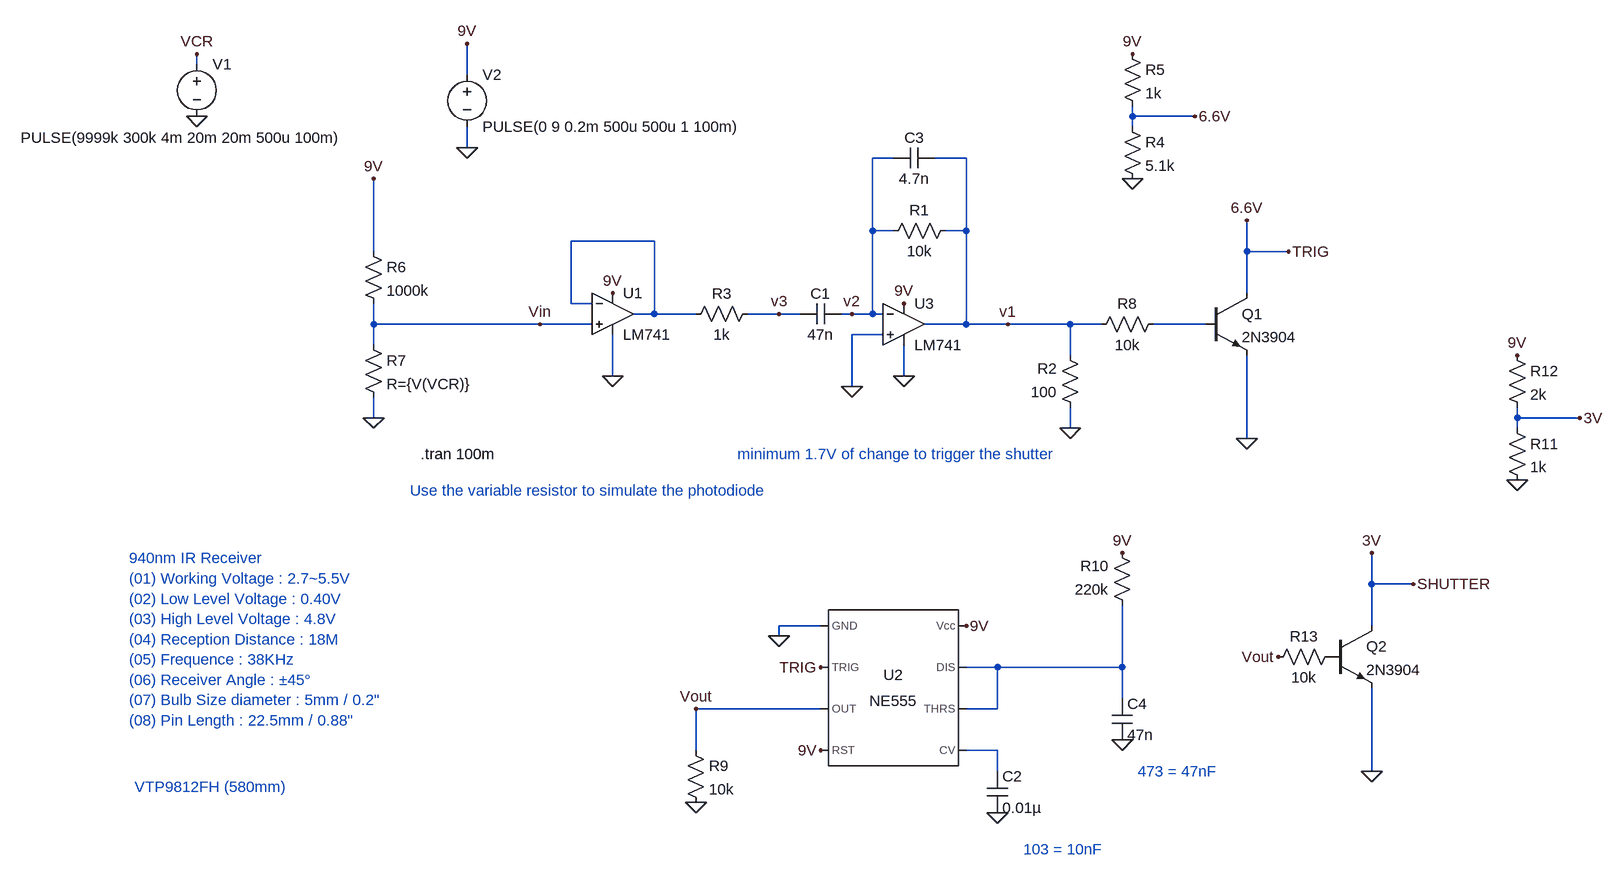
[diagram p0: schematic lightning trigger slow.asc]
lightning trigger slow.asc, the LTspice schematic file:
Version 4
SHEET 1 1220 1080
WIRE -976 -144 -976 -160
WIRE -560 -128 -560 -176
WIRE 464 -64 464 -80
WIRE 560 -64 464 -64
WIRE 464 -48 464 -64
WIRE -560 -16 -560 -48
WIRE 96 0 64 0
WIRE 208 0 160 0
WIRE 64 112 64 0
WIRE 96 112 64 112
WIRE 208 112 208 0
WIRE 208 112 176 112
WIRE -272 128 -400 128
WIRE -704 144 -704 32
WIRE 640 144 640 96
WIRE 704 144 640 144
WIRE 640 208 640 144
WIRE -400 224 -400 128
WIRE -368 224 -400 224
WIRE -272 240 -272 128
WIRE -272 240 -304 240
WIRE -208 240 -272 240
WIRE -80 240 -128 240
WIRE -48 240 -80 240
WIRE 32 240 16 240
WIRE 64 240 64 112
WIRE 64 240 32 240
WIRE 80 240 64 240
WIRE -704 256 -704 224
WIRE -448 256 -704 256
WIRE -368 256 -448 256
WIRE 208 256 208 112
WIRE 208 256 144 256
WIRE 272 256 208 256
WIRE 368 256 272 256
WIRE 416 256 368 256
WIRE 576 256 496 256
WIRE 80 272 32 272
WIRE -704 288 -704 256
WIRE 368 304 368 256
WIRE -336 336 -336 272
WIRE 112 336 112 288
WIRE 32 352 32 272
WIRE -704 400 -704 368
WIRE 1056 400 1056 384
WIRE 1152 400 1056 400
WIRE 368 416 368 384
WIRE 1056 416 1056 400
WIRE 640 432 640 304
WIRE 832 656 832 608
WIRE 896 656 832 656
WIRE -16 720 -80 720
WIRE 832 720 832 656
WIRE -80 736 -80 720
WIRE 256 784 208 784
WIRE 448 784 448 688
WIRE 448 784 256 784
WIRE 448 832 448 784
WIRE -16 848 -208 848
WIRE 256 848 256 784
WIRE 256 848 208 848
WIRE -208 912 -208 848
WIRE 256 912 208 912
WIRE 256 944 256 912
WIRE 832 944 832 816
FLAG 112 224 9V
FLAG 112 336 0
FLAG -448 256 Vin
FLAG -976 -64 0
FLAG -560 -176 9V
FLAG -560 -16 0
FLAG 368 416 0
FLAG 640 432 0
FLAG 464 -160 9V
FLAG -336 208 9V
FLAG -336 336 0
FLAG 704 144 TRIG
FLAG 464 32 0
FLAG 560 -64 6.6V
FLAG 272 256 v1
FLAG -976 -160 VCR
FLAG -704 400 0
FLAG -704 32 9V
FLAG 32 352 0
FLAG 32 240 v2
FLAG -80 240 v3
FLAG 640 96 6.6V
FLAG -80 736 0
FLAG -16 784 TRIG
FLAG -208 848 Vout
FLAG 256 1008 0
FLAG 448 896 0
FLAG 448 608 9V
FLAG 208 720 9V
FLAG -208 992 0
FLAG -16 912 9V
FLAG 832 944 0
FLAG 896 656 SHUTTER
FLAG 832 608 3V
FLAG 1056 304 9V
FLAG 1056 496 0
FLAG 1152 400 3V
FLAG 688 768 Vout
SYMBOL cap 16 224 R90
WINDOW 0 0 32 VBottom 2
WINDOW 3 32 32 VTop 2
SYMATTR InstName C1
SYMATTR Value 47n
SYMBOL res 192 96 R90
WINDOW 0 0 56 VBottom 2
WINDOW 3 32 56 VTop 2
SYMATTR InstName R1
SYMATTR Value 10k
SYMBOL voltage -976 -160 R0
WINDOW 3 -271 129 Left 2
WINDOW 123 0 0 Left 0
WINDOW 39 0 0 Left 0
SYMATTR Value PULSE(9999k 300k 4m 20m 20m 500u 100m)
SYMATTR InstName V1
SYMBOL voltage -560 -144 R0
WINDOW 123 0 0 Left 0
SYMATTR InstName V2
SYMATTR Value PULSE(0 9 0.2m 500u 500u 1 100m)
SYMATTR SpiceLine Rser=0
SYMBOL cap 160 -16 R90
WINDOW 0 0 32 VBottom 2
WINDOW 3 32 32 VTop 2
SYMATTR InstName C3
SYMATTR Value 4.7n
SYMBOL res 384 400 R180
WINDOW 0 36 76 Left 2
WINDOW 3 36 40 Left 2
SYMATTR InstName R2
SYMATTR Value 100
SYMBOL res -224 256 R270
WINDOW 0 32 56 VTop 2
WINDOW 3 0 56 VBottom 2
SYMATTR InstName R3
SYMATTR Value 1k
SYMBOL res 448 -64 R0
SYMATTR InstName R4
SYMATTR Value 5.1k
SYMBOL LM741 112 192 R0
SYMATTR InstName U3
SYMBOL LM741 -336 176 R0
SYMATTR InstName U1
SYMBOL npn 576 208 R0
SYMATTR InstName Q1
SYMATTR Value 2N3904
SYMBOL res 448 -176 R0
SYMATTR InstName R5
SYMATTR Value 1k
SYMBOL res -720 128 R0
SYMATTR InstName R6
SYMATTR Value 1000k
SYMBOL res -720 272 R0
SYMATTR InstName R7
SYMATTR Value R={V(VCR)}
SYMBOL res 512 240 R90
WINDOW 0 0 56 VBottom 2
WINDOW 3 32 56 VTop 2
SYMATTR InstName R8
SYMATTR Value 10k
SYMBOL NE555 96 816 R0
SYMATTR InstName U2
SYMBOL res -224 896 R0
SYMATTR InstName R9
SYMATTR Value 10k
SYMBOL res 464 704 R180
WINDOW 0 36 76 Left 2
WINDOW 3 36 40 Left 2
SYMATTR InstName R10
SYMATTR Value 220k
SYMBOL cap 240 944 R0
SYMATTR InstName C2
SYMATTR Value 0.01µ
SYMBOL cap 432 832 R0
SYMATTR InstName C4
SYMATTR Value 47n
SYMBOL npn 768 720 R0
SYMATTR InstName Q2
SYMATTR Value 2N3904
SYMBOL res 1040 400 R0
SYMATTR InstName R11
SYMATTR Value 1k
SYMBOL res 1040 288 R0
SYMATTR InstName R12
SYMATTR Value 2k
SYMBOL res 784 752 R90
WINDOW 0 0 56 VBottom 2
WINDOW 3 32 56 VTop 2
SYMATTR InstName R13
SYMATTR Value 10k
TEXT -632 456 Left 2 !.tran 100m
TEXT -648 512 Left 2 ;Use the variable resistor to simulate the photodiode
TEXT -144 456 Left 2 ;minimum 1.7V of change to trigger the shutter
TEXT 296 1064 Left 2 ;103 = 10nF
TEXT 472 944 Left 2 ;473 = 47nF
TEXT -1080 616 Left 2 ;940nm IR Receiver\n(01) Working Voltage : 2.7~5.5V\n(02) Low Level Voltage : 0.40V\n(03) High Level Voltage : 4.8V\n(04) Reception Distance : 18M\n(05) Frequence : 38KHz\n(06) Receiver Angle : ±45°\n(07) Bulb Size diameter : 5mm / 0.2"\n(08) Pin Length : 22.5mm / 0.88"
TEXT -1072 968 Left 2 ;VTP9812FH (580mm)

The netlist it stands for:
* lightning trigger slow.asc
C1 v2 v3 47n
R1 v1 v2 10k
V1 VCR 0 PULSE(9999k 300k 4m 20m 20m 500u 100m)
V2 9V 0 PULSE(0 9 0.2m 500u 500u 1 100m) Rser=0
C3 v1 v2 4.7n
R2 0 v1 100
R3 N001 v3 1k
R4 6.6V 0 5.1k
XU3 0 v2 9V 0 v1 LM741  ; pins In+ In- V+ V- OUT
XU1 Vin N001 9V 0 N001 LM741  ; pins In+ In- V+ V- OUT
Q1 6.6V N002 0 0 2N3904
R5 9V 6.6V 1k
R6 9V Vin 1000k
R7 Vin 0 R={V(VCR)}
R8 N002 v1 10k
XU2 0 6.6V Vout 9V N004 N003 N003 9V NE555  ; pins GND TRIG OUT RST CV THRS DIS Vcc
R9 Vout 0 10k
R10 N003 9V 220k
C2 N004 0 0.01µ
C4 N003 0 47n
Q2 3V P001 0 0 2N3904
R11 3V 0 1k
R12 9V 3V 2k
R13 P001 Vout 10k
.model NPN NPN
.model PNP PNP
.lib standard.bjt
.tran 100m
* Use the variable resistor to simulate the photodiode
* minimum 1.7V of change to trigger the shutter
* 103 = 10nF
* 473 = 47nF
* 940nm IR Receiver
* (01) Working Voltage : 2.7~5.5V
* (02) Low Level Voltage : 0.40V
* (03) High Level Voltage : 4.8V
* (04) Reception Distance : 18M
* (05) Frequence : 38KHz
* (06) Receiver Angle : ±45°
* (07) Bulb Size diameter : 5mm / 0.2"
* (08) Pin Length : 22.5mm / 0.88"
* VTP9812FH (580mm)
.lib LM741.lib
.lib NE555.sub
.backanno
.end